# EAGLE design motor (EAGLE 9.2.2)

## Sheet 1 of 2
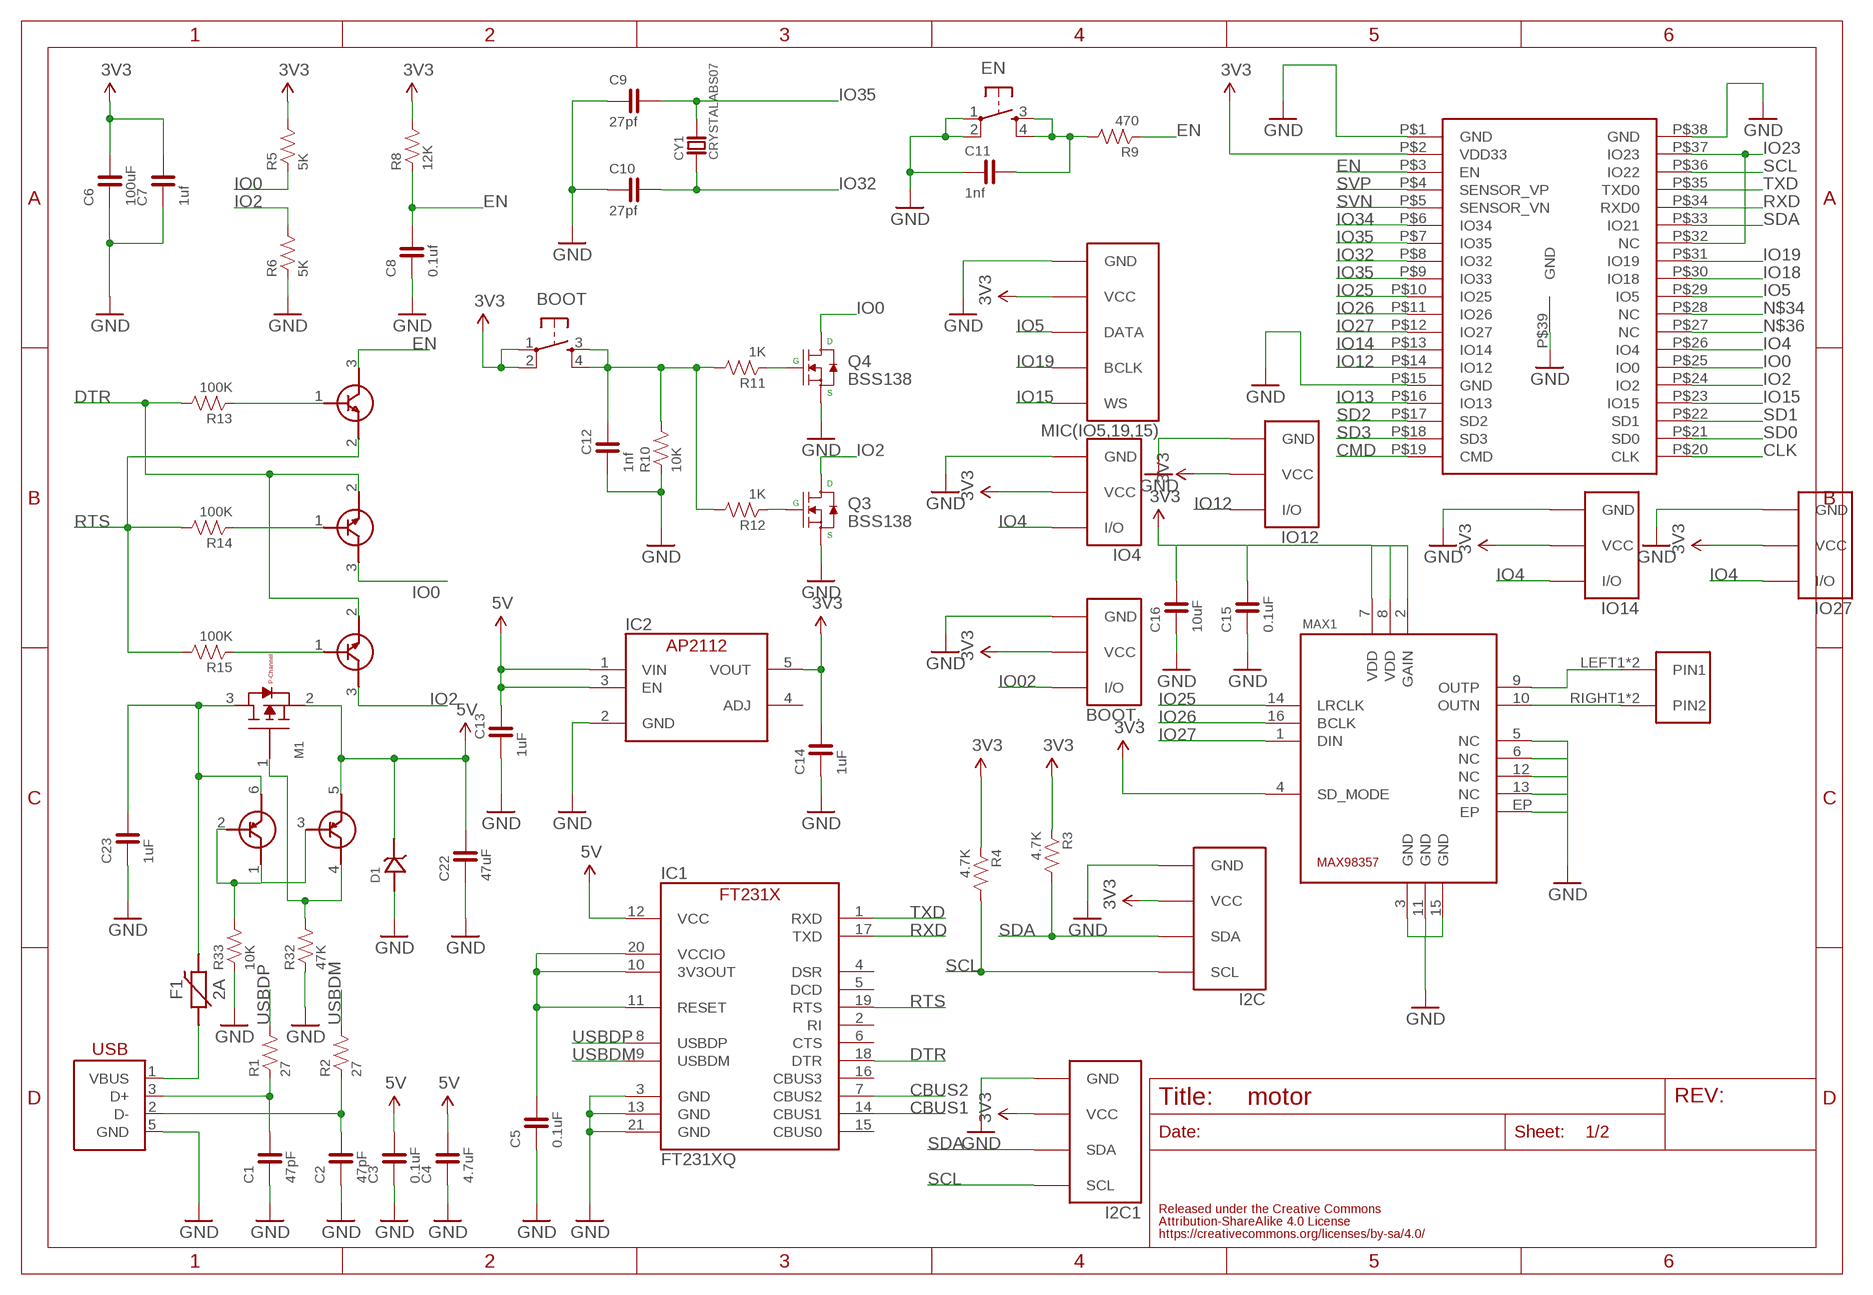
[diagram p0: schematic, sheet 1]

### Parts
BOOT  TACT-SWITCH-SMD_KMR2  [KMR2]
BOOT.  BUTTON  FABO_BRICK_3PIN-03B-PASK-1_NAME_BOTTOM  [FABO_BRICK_3PIN_B03B-PASK-1_NAME_BOTTOM]
C1  47pF  CAPACITOR-0603_NARROW  [0603-NARROW]
C2  47pF  CAPACITOR-0603_NARROW  [0603-NARROW]
C3  0.1uF  CAPACITOR-0603_NARROW  [0603-NARROW]
C4  4.7uF  CAPACITOR-0603_NARROW  [0603-NARROW]
C5  0.1uF  CAPACITOR-0603_NARROW  [0603-NARROW]
C6  100uF  CAPACITOR-1206  [1206]
C7  1uf  CAPACITOR-0603_NARROW  [0603-NARROW]
C8  0.1uf  CAPACITOR-0603_NARROW  [0603-NARROW]
C9  27pf  CAPACITOR-0603_NARROW  [0603-NARROW]
C10  27pf  CAPACITOR-0603_NARROW  [0603-NARROW]
C11  1nf  CAPACITOR-0603_NARROW  [0603-NARROW]
C12  1nf  CAPACITOR-0603_NARROW  [0603-NARROW]
C13  1uF  CAPACITOR-0603  [0603]
C14  1uF  CAPACITOR-0603  [0603]
C15  0.1uF  CAPACITOR-0603  [0603]
C16  10uF  CAPACITOR-0603  [0603]
C22  47uF  CAPACITOR-0603_NARROW  [0603-NARROW]
C23  1uF  CAPACITOR-0603_NARROW  [0603-NARROW]
CY1  CRYSTALABS07  [ABRACOM-ABS07-32.768KHZ]
D1  SMBJ5.0  [SMBJ5.0]
EN  TACT-SWITCH-SMD_KMR2  [KMR2]
F1  2A  POLYSWITCH  [NANOSMDC035F]
I2C  FABO_BRICK_I2C-B04B-PASK-1  [FABO_BRICK_I2C_B04B-PASK-1]
I2C1  FABO_BRICK_I2C-B04B-PASK-1  [FABO_BRICK_I2C_B04B-PASK-1]
IC1  FT231XQ  [QFN-20_FT231X]
IC2  AP2112K-3.3TRG1  [SOT-23-5]
IO4  FABO_BRICK_3PIN-03B-PASK-1_NAME_BOTTOM  [FABO_BRICK_3PIN_B03B-PASK-1_NAME_BOTTOM]
IO12  FABO_BRICK_3PIN-03B-PASK-1_NAME_BOTTOM  [FABO_BRICK_3PIN_B03B-PASK-1_NAME_BOTTOM]
IO14  FABO_BRICK_3PIN-03B-PASK-1_NAME_BOTTOM  [FABO_BRICK_3PIN_B03B-PASK-1_NAME_BOTTOM]
IO27  FABO_BRICK_3PIN-03B-PASK-1_NAME_BOTTOM  [FABO_BRICK_3PIN_B03B-PASK-1_NAME_BOTTOM]
M1  MOSFET-P_DMG2305UX  [SOT-23]
MAX1  MA-MAX98357  [MAXIM-MAX98357]
MIC(IO5,19,15)  FABO_BRICK_I2STOP  [FABO_BRICK_I2S_B05B-PARK-1]
Q3  BSS138  MOSFET-N-BSS138  [SOT23-3]
Q4  BSS138  MOSFET-N-BSS138  [SOT23-3]
R1  27  RESISTOR-0603-NARROW  [0603-NARROW]
R2  27  RESISTOR-0603-NARROW  [0603-NARROW]
R3  4.7K  RESISTOR-0603-NARROW  [0603-NARROW]
R4  4.7K  RESISTOR-0603-NARROW  [0603-NARROW]
R5  5K  RESISTOR-0603-NARROW  [0603-NARROW]
R6  5K  RESISTOR-0603-NARROW  [0603-NARROW]
R8  12K  RESISTOR-0603-NARROW  [0603-NARROW]
R9  470  RESISTOR-0603-NARROW  [0603-NARROW]
R10  10K  RESISTOR-0603-NARROW  [0603-NARROW]
R11  1K  RESISTOR-0603-NARROW  [0603-NARROW]
R12  1K  RESISTOR-0603-NARROW  [0603-NARROW]
R13  100K  RESISTOR-0603-NARROW  [0603-NARROW]
R14  100K  RESISTOR-0603-NARROW  [0603-NARROW]
R15  100K  RESISTOR-0603-NARROW  [0603-NARROW]
R32  47K  RESISTOR-0603-NARROW  [0603-NARROW]
R33  10K  RESISTOR-0603-NARROW  [0603-NARROW]
T1  TRANSISTORMMBT2222  [SOT-23]
T2  TRANSISTORMMBT2222  [SOT-23]
T3  TRANSISTORMMBT2222  [SOT-23]
U$1  ESP32-WROVER  [ESP32-WROVER]
U$4  ML-1400-S1  [ML-1400-S1]
U$6  DUAL-PNP-TRANSISTORDMMT5401  [SOT-26]
USB1  USB-MICRO_B_SMT_HIROSE  [ZX62R-B-5P]

### Nets
3V3: BOOT.1 BOOT.2 BOOT..VCC C6.- C7.2 C14.2 C15.2 C16.2 I2C1.VCC I2C.VCC IC2.5(VOUT) IO4.VCC IO12.VCC IO14.VCC IO27.VCC MAX1.2(GAIN) MAX1.4(SD_MODE) MAX1.7(VDD) MAX1.8(VDD) MIC(IO5,19,15).VCC R3.1 R4.1 R5.2 R8.2 U$1.P$2(VDD33) ; also sheet 2
5V: C3.2 C4.2 C13.2 C22.2 D1.ANODE IC1.12(VCC) IC2.1(VIN) IC2.3(EN) M1.2(S) U$6.5(E2) ; also sheet 2
CBUS1: IC1.14(CBUS1)
CBUS2: IC1.7(CBUS2)
CLK: U$1.P$20(CLK)
CMD: U$1.P$19(CMD)
DTR: IC1.18(DTR) R13.2 T2.2(E) T3.2(E)
EN: C8.2 R8.1 R9.1 T1.3(C) U$1.P$3(EN)
GND: BOOT..GND C1.1 C2.1 C3.1 C4.1 C5.1 C6.+ C7.1 C8.1 C9.1 C10.1 C11.1 C12.1 C13.1 C14.1 C15.1 C16.1 C22.1 C23.1 D1.CATHODE EN.1 EN.2 I2C1.GND I2C.GND IC1.3(GND) IC1.13(GND) IC1.21(GND) IC2.2(GND) IO4.GND IO12.GND IO14.GND IO27.GND MAX1.3(GND) MAX1.5(NC) MAX1.6(NC) MAX1.11(GND) MAX1.12(NC) MAX1.13(NC) MAX1.15(GND) MAX1.EP MIC(IO5,19,15).GND Q3.2(S) Q4.2(S) R6.1 R10.1 R32.1 R33.1 U$1.P$1(GND) U$1.P$15(GND) U$1.P$38(GND) U$1.P$39(GND) USB1.5(GND) ; also sheet 2
IO0: Q4.3(D) R5.1 T2.3(C) U$1.P$25(IO0)
IO2: Q3.3(D) R6.2 T3.3(C) U$1.P$24(IO2)
IO02: BOOT..I/O
IO4: IO4.I/O IO14.I/O IO27.I/O U$1.P$26(IO4)
IO5: MIC(IO5,19,15).DATA U$1.P$29(IO5)
IO12: IO12.I/O U$1.P$14(IO12)
IO13: U$1.P$16(IO13)
IO14: U$1.P$13(IO14)
IO15: MIC(IO5,19,15).WS U$1.P$23(IO15)
IO18: U$1.P$30(IO18)
IO19: MIC(IO5,19,15).BCLK U$1.P$31(IO19)
IO23: U$1.P$32(NC) U$1.P$37(IO23)
IO25: MAX1.14(LRCLK) U$1.P$10(IO25)
IO26: MAX1.16(BCLK) U$1.P$11(IO26)
IO27: MAX1.1(DIN) U$1.P$12(IO27)
IO32: C10.2 CY1.P$1 U$1.P$8(IO32)
IO34: U$1.P$6(IO34) ; also sheet 2
IO35: C9.2 CY1.P$2 U$1.P$7(IO35) U$1.P$9(IO33) ; also sheet 2
N$1: R13.1 T1.1(B)
N$2: R14.1 T2.1(B)
N$3: C2.2 R2.1 USB1.2(D-)
N$4: C1.2 R1.1 USB1.3(D+)
N$5: C11.2 EN.3 EN.4 R9.2
N$6: BOOT.3 BOOT.4 C12.2 R10.2 R11.2 R12.2
N$7: C5.2 IC1.10(3V3OUT) IC1.11(RESET) IC1.20(VCCIO)
N$8: R15.1 T3.1(B)
N$9: MAX1.10(OUTN) U$4.RIGHT1(PIN2) U$4.RIGHT2(PIN2)
N$10: MAX1.9(OUTP) U$4.LEFT1(PIN1) U$4.LEFT2(PIN1)
N$11: Q4.1(G) R11.1
N$12: Q3.1(G) R12.1
N$16: C23.2 F1.2 M1.3(D) U$6.6(E1)
N$17: M1.1(G) R32.2 U$6.4(C2)
N$26: R33.2 U$6.1(C1) U$6.2(B1) U$6.3(B2)
N$34: U$1.P$28(NC)
N$36: U$1.P$27(NC)
RTS: IC1.19(RTS) R14.2 R15.2 T1.2(E)
RXD: IC1.17(TXD) U$1.P$34(RXD0)
SCL: I2C1.SCL I2C.SCL R4.2 U$1.P$36(IO22) ; also sheet 2
SD0: U$1.P$21(SD0)
SD1: U$1.P$22(SD1)
SD2: U$1.P$17(SD2)
SD3: U$1.P$18(SD3)
SDA: I2C1.SDA I2C.SDA R3.2 U$1.P$33(IO21) ; also sheet 2
SVN: U$1.P$5(SENSOR_VN)
SVP: U$1.P$4(SENSOR_VP)
TXD: IC1.1(RXD) U$1.P$35(TXD0)
USBDM: IC1.9(USBDM) R2.2 ; also sheet 2
USBDP: IC1.8(USBDP) R1.2 ; also sheet 2
VBUS: F1.1 USB1.1(VBUS)
Unconnected: IC1.2(RI) IC1.4(DSR) IC1.5(DCD) IC1.6(CTS) IC1.15(CBUS0) IC1.16(CBUS3) IC2.4(ADJ)

## Sheet 2 of 2
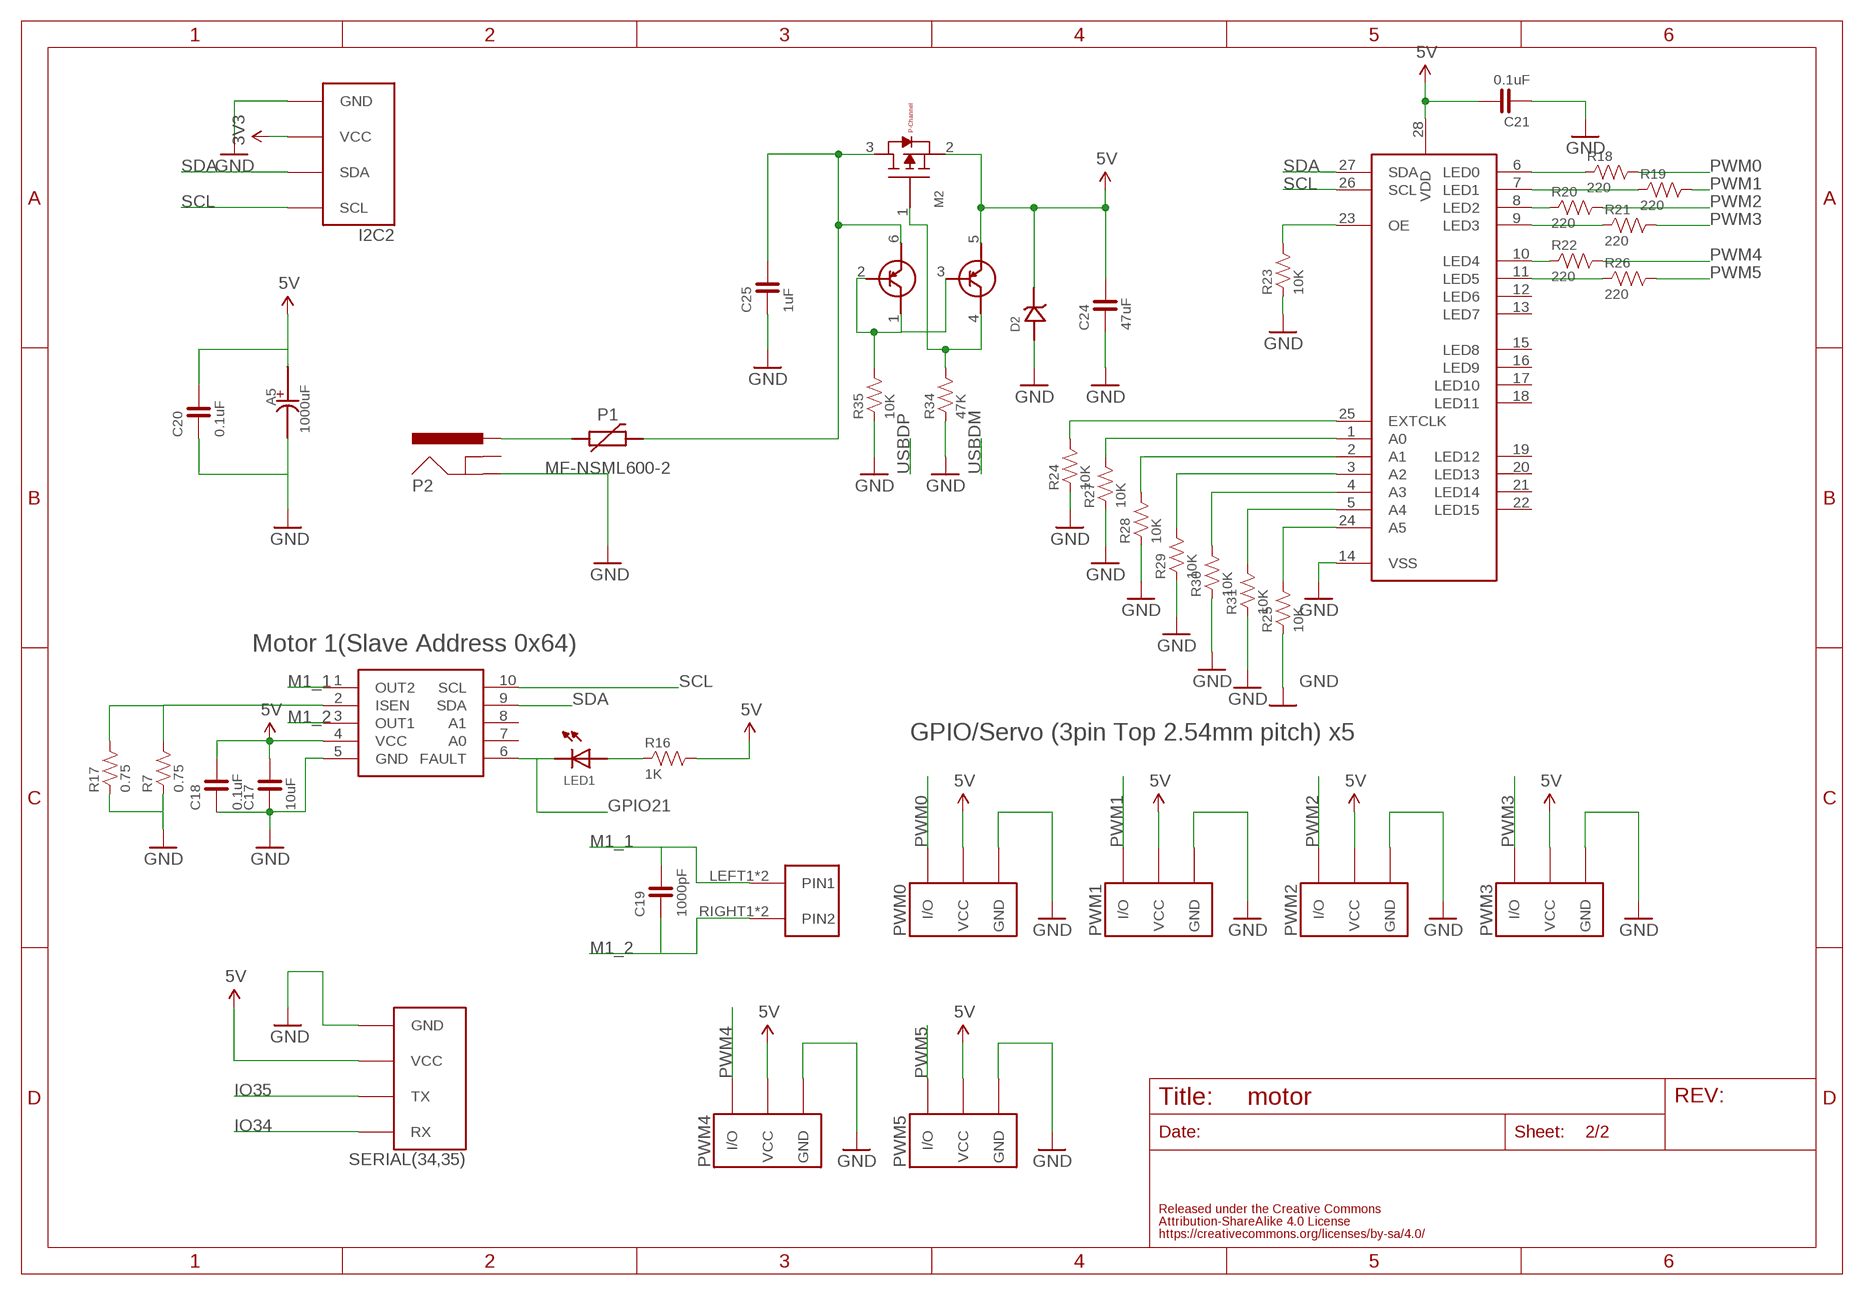
[diagram p1: schematic, sheet 2]

### Parts
A5  1000uF  CAPACITOR-ALUMIN_D12_5  [D12.5]
C17  10uF  CAPACITOR-0603  [0603]
C18  0.1uF  CAPACITOR-0603  [0603]
C19  1000pF  CAPACITOR-0603  [0603]
C20  0.1uF  CAPACITOR-0603  [0603]
C21  0.1uF  CAPACITOR-0603  [0603]
C24  47uF  CAPACITOR-0603_NARROW  [0603-NARROW]
C25  1uF  CAPACITOR-0603_NARROW  [0603-NARROW]
D2  SMBJ5.0  [SMBJ5.0]
I2C2  FABO_BRICK_I2C-B04B-PASK-1  [FABO_BRICK_I2C_B04B-PASK-1]
LED1  LED-0603  [0603]
M2  MOSFET-P_DMG2305UX  [SOT-23]
P1  MF-NSML600-2  POLYSWITCH1206  [1206]
P2  DC-JACKM04339A0  [M04339A0]
PWM0  FABO_BRICK_3PIN-HEADER  [FABO_BRICK_3PIN_HEADER]
PWM1  FABO_BRICK_3PIN-HEADER  [FABO_BRICK_3PIN_HEADER]
PWM2  FABO_BRICK_3PIN-HEADER  [FABO_BRICK_3PIN_HEADER]
PWM3  FABO_BRICK_3PIN-HEADER  [FABO_BRICK_3PIN_HEADER]
PWM4  FABO_BRICK_3PIN-HEADER  [FABO_BRICK_3PIN_HEADER]
PWM5  FABO_BRICK_3PIN-HEADER  [FABO_BRICK_3PIN_HEADER]
R7  0.75  RESISTOR-0603  [0603]
R16  1K  RESISTOR-0603  [0603]
R17  0.75  RESISTOR-0603  [0603]
R18  220  RESISTOR-0603  [0603]
R19  220  RESISTOR-0603  [0603]
R20  220  RESISTOR-0603  [0603]
R21  220  RESISTOR-0603  [0603]
R22  220  RESISTOR-0603  [0603]
R23  10K  RESISTOR-0603  [0603]
R24  10K  RESISTOR-0603  [0603]
R25  10K  RESISTOR-0603  [0603]
R26  220  RESISTOR-0603  [0603]
R27  10K  RESISTOR-0603  [0603]
R28  10K  RESISTOR-0603  [0603]
R29  10K  RESISTOR-0603  [0603]
R30  10K  RESISTOR-0603  [0603]
R31  10K  RESISTOR-0603  [0603]
R34  47K  RESISTOR-0603-NARROW  [0603-NARROW]
R35  10K  RESISTOR-0603-NARROW  [0603-NARROW]
SERIAL(34,35)  FABO_BRICK_SERIAL-B04B-PASK-1  [FABO_BRICK_SERIAL_B04B-PASK-1]
U$7  DUAL-PNP-TRANSISTORDMMT5401  [SOT-26]
U$8  DRV8830  [DRV8830]
U$9  PCA9685  [PCA9685]
U$12  ML-1400-S1  [ML-1400-S1]

### Nets
3V3: I2C2.VCC ; also sheet 1
5V: A5.+ C17.2 C18.2 C20.2 C21.2 C24.2 D2.ANODE M2.2(S) PWM0.VCC PWM1.VCC PWM2.VCC PWM3.VCC PWM4.VCC PWM5.VCC R16.2 SERIAL(34,35).VCC U$7.5(E2) U$8.4(VCC) U$9.28(VDD) ; also sheet 1
GND: A5.- C17.1 C18.1 C20.1 C21.1 C24.1 C25.1 D2.CATHODE I2C2.GND P2.GND PWM0.GND PWM1.GND PWM2.GND PWM3.GND PWM4.GND PWM5.GND R7.1 R17.1 R23.1 R24.1 R25.1 R27.1 R28.1 R29.1 R30.1 R31.1 R34.1 R35.1 SERIAL(34,35).GND U$8.5(GND) U$9.14(VSS) ; also sheet 1
GPIO21: LED1.CATHODE U$8.6(FAULT)
IO34: SERIAL(34,35).RX ; also sheet 1
IO35: SERIAL(34,35).TX ; also sheet 1
LED0: R18.1 U$9.6(LED0)
LED1: R19.1 U$9.7(LED1)
LED2: R20.1 U$9.8(LED2)
LED3: R21.1 U$9.9(LED3)
LED4: R22.1 U$9.10(LED4)
LED5: R26.1 U$9.11(LED5)
M1_1: C19.2 U$8.1(OUT2) U$12.LEFT1(PIN1) U$12.LEFT2(PIN1)
M1_2: C19.1 U$8.3(OUT1) U$12.RIGHT1(PIN2) U$12.RIGHT2(PIN2)
N$13: R7.2 R17.2 U$8.2(ISEN)
N$14: LED1.ANODE R16.1
N$15: P1.P$1 P2.VCC(PWR)
N$18: R23.2 U$9.23(OE)
N$19: R24.2 U$9.25(EXTCLK)
N$20: R27.2 U$9.1(A0)
N$21: R28.2 U$9.2(A1)
N$22: R29.2 U$9.3(A2)
N$23: R30.2 U$9.4(A3)
N$24: R31.2 U$9.5(A4)
N$25: R25.2 U$9.24(A5)
N$28: C25.2 M2.3(D) P1.P$2 U$7.6(E1)
N$29: M2.1(G) R34.2 U$7.4(C2)
N$30: R35.2 U$7.1(C1) U$7.2(B1) U$7.3(B2)
PWM0: PWM0.I/O R18.2
PWM1: PWM1.I/O R19.2
PWM2: PWM2.I/O R20.2
PWM3: PWM3.I/O R21.2
PWM4: PWM4.I/O R22.2
PWM5: PWM5.I/O R26.2
SCL: I2C2.SCL U$8.10(SCL) U$9.26(SCL) ; also sheet 1
SDA: I2C2.SDA U$8.9(SDA) U$9.27(SDA) ; also sheet 1
Unconnected: P2.GNDBREAK U$8.7(A0) U$8.8(A1) U$9.12(LED6) U$9.13(LED7) U$9.15(LED8) U$9.16(LED9) U$9.17(LED10) U$9.18(LED11) U$9.19(LED12) U$9.20(LED13) U$9.21(LED14) U$9.22(LED15)

### Notes on the sheet
- Motor 1(Slave Address 0x64)
- GPIO/Servo (3pin Top 2.54mm pitch) x5

## Library data of the parts
A5 = FaBo-Capacitor:CAPACITOR-ALUMIN
BOOT EN = FaBo-Switch:TACT-SWITCH
BOOT. IO4 IO12 IO14 IO27 PWM0 PWM1-PWM5 = FaBo-Template:FABO_BRICK_3PIN: FaBo Brick 3pin
C1-C25 = FaBo-Capacitor:CAPACITOR: CAPACITOR
CY1 = FaBo-Crystal:CRYSTAL
D1 D2 = FaBo-Diode:SMBJ5.0
F1 = FaBo-Parts:POLYSWITCH
I2C I2C1 I2C2 = FaBo-Template:FABO_BRICK_I2C: FaBo Brick I2C
IC1 = FaBo-USB:FT231X
IC2 = FaBo-Supply:AP2112
LED1 = FaBo-LED:LED
M1 M2 = FaBo-Mosfet:MOSFET-P
MAX1 = FaBo-Mems:MA-MAX98357
MIC(IO5,19,15) = FaBo-Template:FABO_BRICK_I2S
P1 = FaBo-Supply:POLYSWITCH
P2 = FaBo-Supply:DC-JACK
Q3 Q4 = FaBo-etc:MOSFET-N
R1-R35 = FaBo-Resistors:RESISTOR: RESISTOR
SERIAL(34,35) = FaBo-Template:FABO_BRICK_SERIAL: FaBo Brick Serial
T1-T3 = FaBo-Transistor:TRANSISTOR
U$1 = FaBo-ESP32:ESP32-WROVER
U$4 U$12 = FaBo-Terminal:ML-1400-S1
U$6 U$7 = FaBo-Transistor:DUAL-PNP-TRANSISTOR
U$8 = FaBo-Motor:DRV8830
U$9 = FaBo-Motor:PCA9685
USB1 = FaBo-USB:USB

## Board
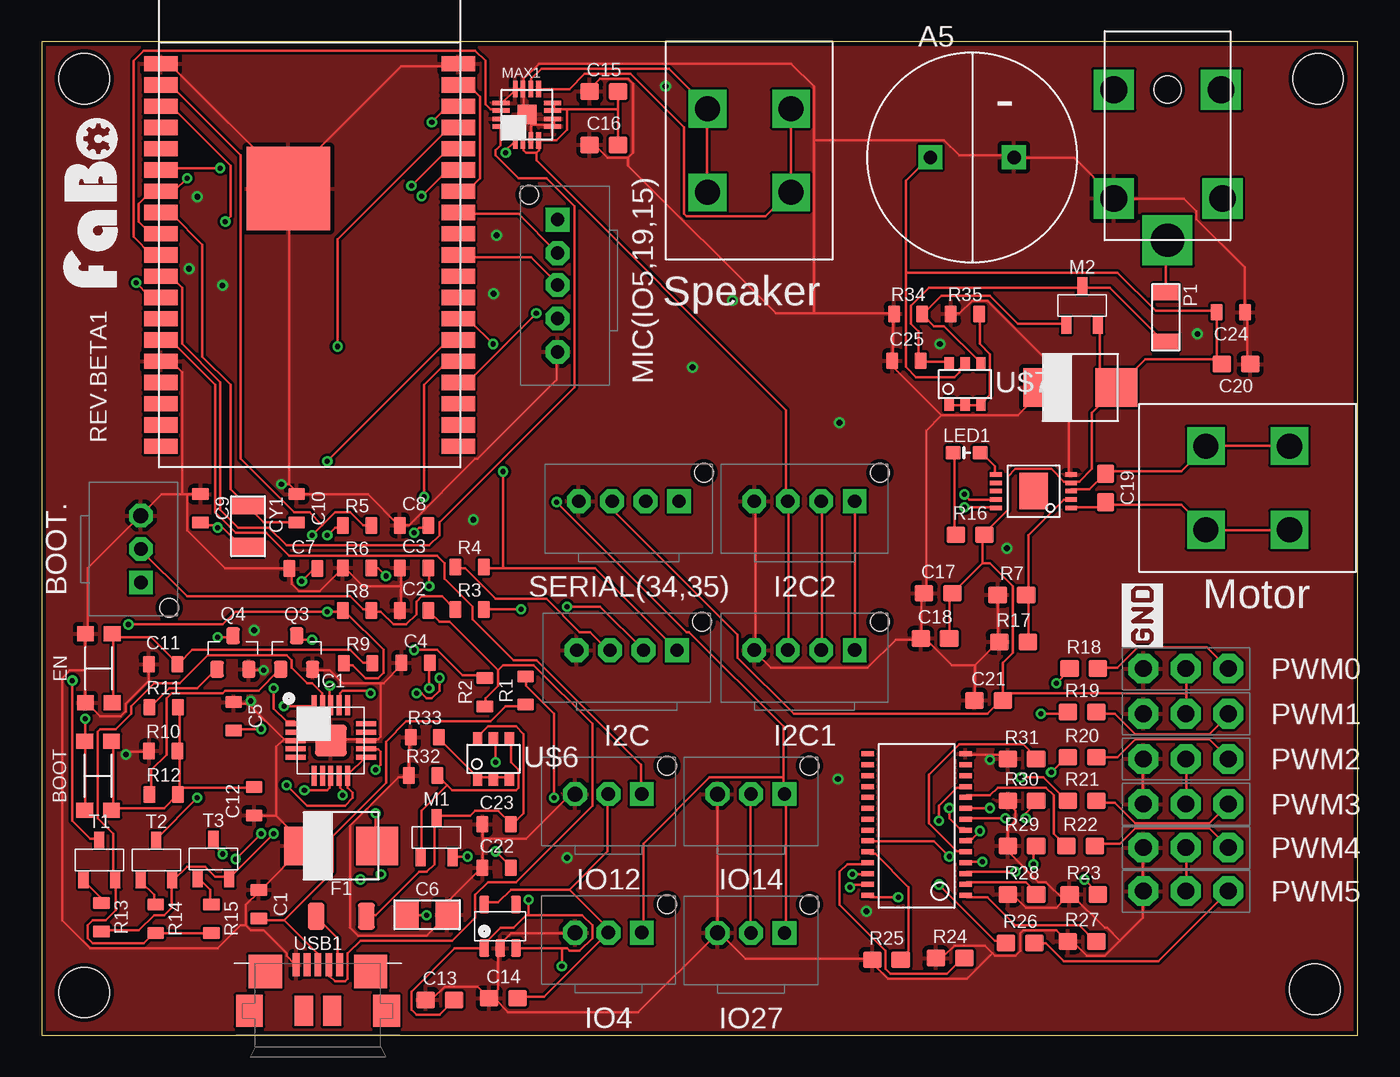
[diagram p2: board, top side]
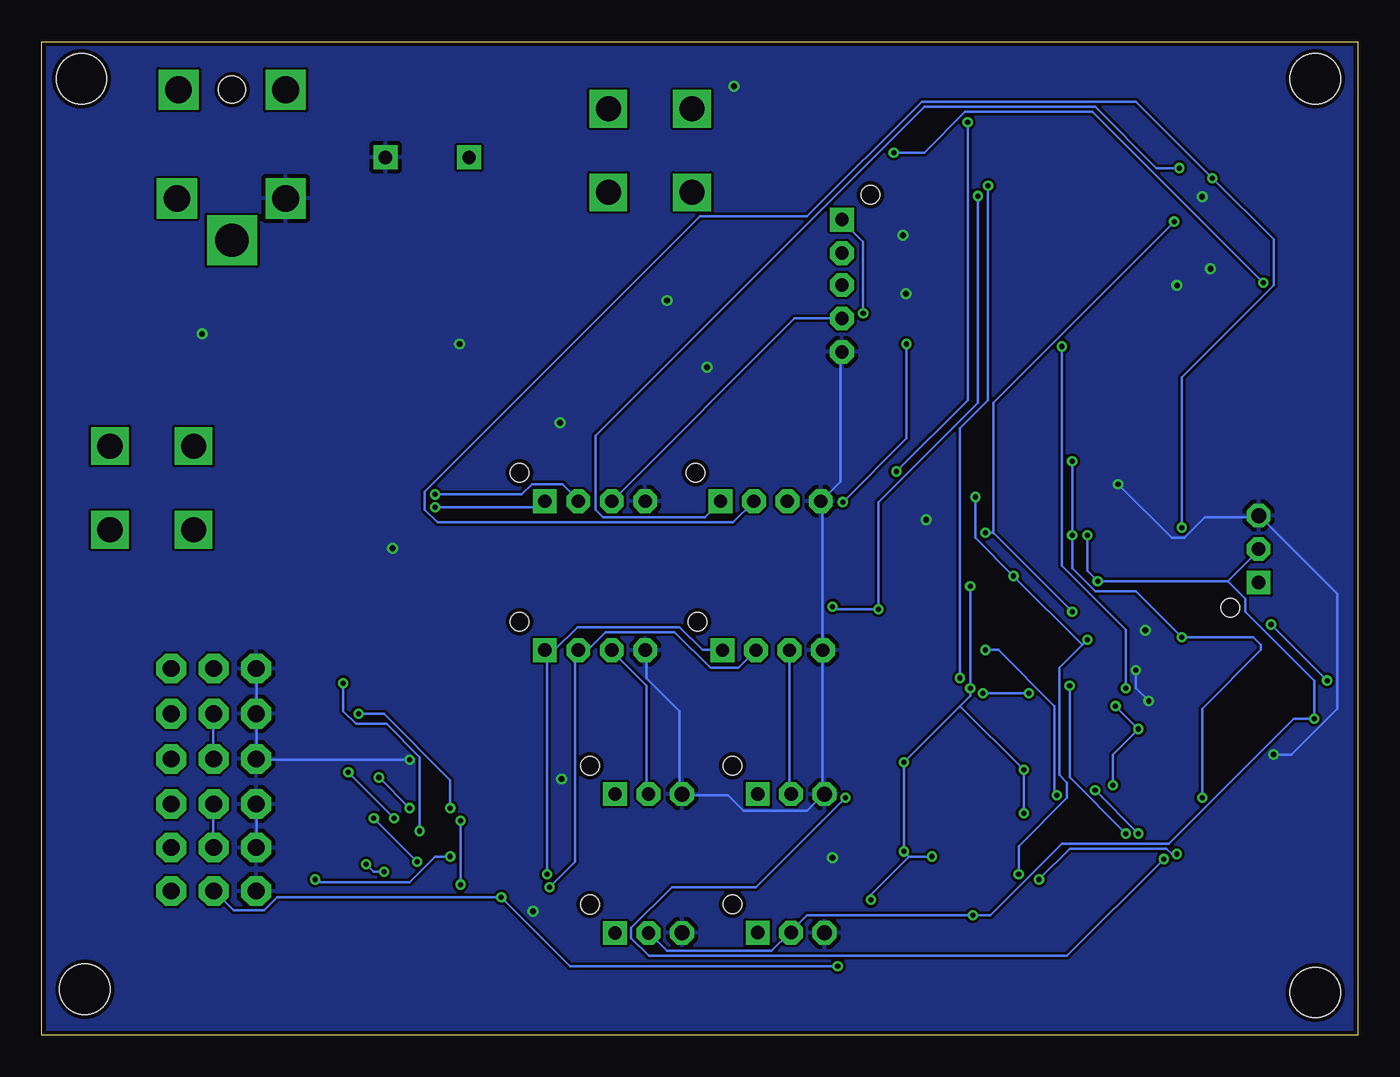
[diagram p3: board, bottom side, seen from below]

Size 78.67 x 59.36 mm. Coordinates in mm from the lower left corner, seen from the top.
Outline: 0,59.36 0,0 78.67,0 78.67,59.36 0,59.36
Copper layers (1*16): Top 0.035mm / dielectric 1.5mm / Bottom 0.035mm
Design rules "SeeedStudio_2layer_DRU_no_angle_20140221": minimum track width 6mil, minimum drill 12mil, track to track 6mil, track to pad 6mil, pad to pad 6mil, via to via 6mil, smd to smd 0mil, copper to edge 10mil, drill to drill 10mil, minimum pad ring 10mil, minimum via ring 6mil, stop-mask expansion 2mil, vias tented up to drill 100mil, thermal gap 10mil
Holes 3 mm at 2.54,57.15 2.54,2.54 76.1,2.74 76.3,57.15

### Footprints (pad centres in the part's own frame; a part is rotated, then mirrored left to right if it is on the bottom)
D12.5 = drill 0.8 pad 1.422 square: + -2.472,0.254; - 2.528,0.254
KMR2 = smd 0.9 x 1: 1 -2.05,0.8; 2 2.05,0.8; 3 2.05,-0.8; 4 -2.05,-0.8
FABO_BRICK_3PIN_B03B-PASK-1_NAME_BOTTOM = drill 0.9 pad 1.422 octagon: GND -2,0 | drill 0.8 pad 1.422 square: I/O 2,0 | drill 0.8 pad 1.422 octagon: VCC 0,0 | hole 1.1: 3.5,1.7
0603-NARROW = smd 0.71 x 1: 1 -0.85,0; 2 0.85,0
1206 = smd 1.4 x 1.6: + 1.2,0; - -1.2,0
0603 = smd 1.1 x 1: 1 -0.85,0; 2 0.85,0
ABRACOM-ABS07-32.768KHZ = smd 1.1 x 1.9: P$1 -1.25,0; P$2 1.25,0
SMBJ5.0 = smd 2.5 x 2.3: ANODE 2.15,0; CATHODE -2.15,0
NANOSMDC035F = smd 1 x 1.6: 1 -1.5,0; 2 1.5,0
FABO_BRICK_I2C_B04B-PASK-1 = drill 0.8 pad 1.422 octagon: GND -3,0; SDA 1,0; VCC -1,0 | drill 0.8 pad 1.422 square: SCL 3,0 | hole 1.1: 4.5,1.7
QFN-20_FT231X = smd 1.2 x 0.3: 1 -2.1,1; 2 -2.1,0.5; 3 -2.1,0; 4 -2.1,-0.5; 5 -2.1,-1; 11 2.1,-1; 12 2.1,-0.5; 13 2.1,0; 14 2.1,0.5; 15 2.1,1 | smd 0.3 x 1.2: 6 -1,-2.1; 7 -0.5,-2.1; 8 0,-2.1; 9 0.5,-2.1; 10 1,-2.1; 16 1,2.1; 17 0.5,2.1; 18 0,2.1; 19 -0.5,2.1; 20 -1,2.1 | smd 1.9 x 1.9: 21 0,0
SOT-23-5 = smd 0.6 x 1.05: 1 -0.95,-1.3; 2 0,-1.3; 3 0.95,-1.3; 4 0.95,1.3; 5 -0.95,1.3
0603' = smd 0.9 x 0.8: ANODE -0.8,0; CATHODE 0.8,0
SOT-23 = smd 0.6 x 1: 1 -0.95,-1.2; 2 0.95,-1.2; 3 0,1.2
MAXIM-MAX98357 = smd 0.27 x 1: 1 -0.7,-1.54; 2 -0.25,-1.54; 3 0.25,-1.54; 4 0.7,-1.54; 9 0.7,1.54; 10 0.25,1.54; 11 -0.25,1.54; 12 -0.7,1.54 | smd 1 x 0.27: 5 1.54,-0.7; 6 1.54,-0.25; 7 1.54,0.25; 8 1.54,0.7; 13 -1.54,0.7; 14 -1.54,0.25; 15 -1.54,-0.25; 16 -1.54,-0.7 | smd 1.143 x 1.143: EP 0.005,0.02
FABO_BRICK_I2S_B05B-PARK-1 = drill 0.8 pad 1.422 octagon: BCLK 1.635,2.54; DATA -0.27,2.54; GND -4.27,2.54; VCC -2.27,2.54 | drill 0.8 pad 1.422 square: WS 3.635,2.54 | hole 1.1: 5.135,4.24
1206' = smd 1 x 1.6: P$1 -1.5,0; P$2 1.5,0
M04339A0 = drill 1.6 square: GND -3.2,-6.5; GNDBREAK 3.3,-6.5; ND1 -3.2,0; ND2 3.2,0 | drill 2 square: VCC 0,-9 | hole 1.6: 0,0
FABO_BRICK_3PIN_HEADER = drill 1 pad 1.778 octagon: GND -2.54,0; I/O 2.54,0; VCC 0,0
SOT23-3 = smd 0.8 x 1: 1 -0.95,-1; 2 0.95,-1; 3 0,1
FABO_BRICK_SERIAL_B04B-PASK-1 = drill 0.8 pad 1.422 octagon: GND -3,0; TX 1,0; VCC -1,0 | drill 0.8 pad 1.422 square: RX 3,0 | hole 1.1: 4.5,1.7
ESP32-WROVER = smd 2 x 0.9: P$1 -8.89,8.89; P$2 -8.89,7.62; P$3 -8.89,6.35; P$4 -8.89,5.08; P$5 -8.89,3.81; P$6 -8.89,2.54; P$7 -8.89,1.27; P$8 -8.89,0; P$9 -8.89,-1.27; P$10 -8.89,-2.54; P$11 -8.89,-3.81; P$12 -8.89,-5.08; P$13 -8.89,-6.35; P$14 -8.89,-7.62; P$15 -8.89,-8.89; P$16 -8.89,-10.16; P$17 -8.89,-11.43; P$18 -8.89,-12.7; P$19 -8.89,-13.97; P$20 8.89,-13.97; P$21 8.89,-12.7; P$22 8.89,-11.43; P$23 8.89,-10.16; P$24 8.89,-8.89; P$25 8.89,-7.62; P$26 8.89,-6.35; P$27 8.89,-5.08; P$28 8.89,-3.81; P$29 8.89,-2.54; P$30 8.89,-1.27; P$31 8.89,0; P$32 8.89,1.27; P$33 8.89,2.54; P$34 8.89,3.81; P$35 8.89,5.08; P$36 8.89,6.35; P$37 8.89,7.62; P$38 8.89,8.89 | smd 5 x 5: P$39 -1.27,1.43
ML-1400-S1 = drill 1.5 square: LEFT1 -2.5,2.5; LEFT2 -2.5,-2.5; RIGHT1 2.5,2.5; RIGHT2 2.5,-2.5
SOT-26 = smd 0.55 x 0.8: 1 -0.95,-1.2; 2 0,-1.2; 3 0.95,-1.2; 4 0.95,1.2; 5 0,1.2; 6 -0.95,1.2
DRV8830 = smd 0.27 x 0.7: 1 -1,-2.24; 2 -0.5,-2.24; 3 0,-2.24; 4 0.5,-2.24; 5 1,-2.24; 6 1,2.26; 7 0.5,2.26; 8 0,2.26; 9 -0.5,2.26; 10 -1,2.26 | smd 2.18 x 1.72: P$1 0,0
PCA9685 = smd 0.3 x 0.75: 1 -4.15,-2.93; 2 -3.5,-2.93; 3 -2.85,-2.93; 4 -2.2,-2.93; 5 -1.55,-2.93; 6 -0.9,-2.93; 7 -0.25,-2.93; 8 0.4,-2.93; 9 1.05,-2.93; 10 1.7,-2.93; 11 2.35,-2.93; 12 3,-2.93; 13 3.65,-2.93; 14 4.3,-2.93; 15 4.3,2.92; 16 3.65,2.92; 17 3,2.92; 18 2.35,2.92; 19 1.7,2.92; 20 1.05,2.92; 21 0.4,2.92; 22 -0.25,2.92; 23 -0.9,2.92; 24 -1.55,2.92; 25 -2.2,2.92; 26 -2.85,2.92; 27 -3.5,2.92; 28 -4.15,2.92
ZX62R-B-5P = smd 0.4 x 1.35: 1 1.3,4.2; 2 0.65,4.2; 3 0,4.2; 4 -0.65,4.2; 5 -1.3,4.2 | smd 2 x 2: 6 3.15,3.8; 7 -3.15,3.8 | smd 1.6 x 1.9: 8 4.1,1.45; 11 -4.1,1.45 | smd 1.1 x 1.8: 9 0.85,1.45; 10 -0.85,1.45

### Placement (x,y rotation side)
A5  55.6,52.2 0 top
BOOT  3.37,15.49 90 top
BOOT.  5.92,29.05 270 top
C1  12.97,7.82 270 top
C2  22.25,25.38 0 top
C3  22.25,27.92 0 top
C4  22.35,22.25 0 top
C5  11.47,19.05 270 top
C6  23.04,7.19 0 top
C7  15.64,27.88 0 top
C8  22.25,30.46 0 top
C9  9.49,31.48 270 top
C10  15.24,31.48 270 top
C11  7.25,22.16 0 top
C12  12.7,13.97 90 top
C13  23.8,2.1 0 top
C14  27.6,2.2 0 top
C15  33.6,56.4 0 top
C16  33.6,53.2 0 top
C17  53.6,26.4 0 top
C18  53.4,23.7 0 top
C19  63.6,32.7 270 top
C20  71.4,40.1 180 top
C21  56.6,20 0 top
C22  27.2,10 0 top
C23  27.2,12.6 0 top
C24  71.1,43.2 180 top
C25  51.7,40.3 0 top
CY1  12.33,30.41 270 top
D1  17.9,11.3 0 top
D2  62.1,38.7 0 top
EN  3.4,21.92 90 top
F1  17.9,7.1 0 top
I2C  34.98,23 0 top
I2C1  45.6,23 0 top
I2C2  45.6,31.9 0 top
IC1  17.28,17.6 0 top
IC2  27.4,6.5 0 top
IO4  33.88,6.12 0 top
IO12  33.88,14.4 0 top
IO14  42.4,14.4 0 top
IO27  42.4,6.1 0 top
LED1  [0603']  55.3,34.8 0 top
M1  23.6,11.8 0 top
M2  62.2,43.6 0 top
MAX1  29,55 0 top
MIC(IO5,19,15)  33.38,45.09 90 top
P1  MF-NSML600-2  [1206']  67.2,42.9 270 top
P2  67.3,56.5 0 top
PWM0  68.4,21.9 0 top
PWM1  68.4,19.2 0 top
PWM2  68.4,16.5 0 top
PWM3  68.4,13.8 0 top
PWM4  68.4,11.2 0 top
PWM5  68.4,8.6 0 top
Q3  15.24,22.86 0 top
Q4  11.43,22.86 0 top
R1  28.92,20.59 90 top
R2  26.48,20.49 90 top
R3  25.57,25.43 0 top
R4  25.57,27.98 0 top
R5  18.84,30.46 0 top
R6  18.84,27.92 0 top
R7  58,26.3 0 top
R8  18.84,25.38 0 top
R9  18.91,22.21 0 top
R10  7.27,16.98 0 top
R11  7.29,19.59 0 top
R12  7.28,14.38 0 top
R13  3.57,7.05 270 top
R14  6.81,6.95 270 top
R15  10.15,6.95 270 top
R16  55.5,29.9 0 top
R17  58.1,23.5 0 top
R18  62.3,21.9 0 top
R19  62.2,19.3 0 top
R20  62.2,16.6 0 top
R21  62.2,14 0 top
R22  62.1,11.3 0 top
R23  62.3,8.4 0 top
R24  54.3,4.6 0 top
R25  50.5,4.5 0 top
R26  58.5,5.5 0 top
R27  62.2,5.6 0 top
R28  58.6,8.4 0 top
R29  58.6,11.3 0 top
R30  58.6,14 0 top
R31  58.6,16.5 0 top
R32  22.8,15.5 0 top
R33  22.9,17.8 0 top
R34  51.8,43.1 0 top
R35  55.2,43.1 0 top
SERIAL(34,35)  35.1,31.9 0 top
T1  3.44,10.46 0 top
T2  6.85,10.46 0 top
T3  10.26,10.52 0 top
U$1  16.01,49.16 0 top
U$4  42.3,52.86 180 top
U$5  [LOGO_FABO_MS]  4.9,49.75 90 top
U$6  27,16.5 0 top
U$7  55.2,38.9 0 top
U$8  59.3,32.5 90 top
U$9  52.3,12.5 90 top
U$12  72.1,32.7 90 top
U$19  [LOGO_SILK_GND]  67.07,23.17 90 top
USB1  16.51,0 0 top

### Tracks (layer width: path | path; a pad name or v marks a point on that pad's centre or on a via)
3V3  (via drill 0.3)
  Top 0.152: R3.1 24.69,25.45 23.93,26.21 22.71,26.21 22.4,25.91 22.4,25.15 21.79,24.54 21.03,24.54 20.27,25.3 19.81,25.3 R8.2 19.66,25.45 19.2,25.45 18.44,26.21 8.69,26.21 5.94,28.96 BOOT..VCC | BOOT.1 2.59,13.56 2.59,17.53 BOOT.2 2.59,17.68 v2.59,18.9 | v15.54,27.13 16.15,27.74 16.46,27.74 C7.2 | v16.15,29.87 16.76,30.48 | 16.76,30.48 17.53,31.24 18.44,31.24 19.2,30.48 19.66,30.48 R5.2 | 16.76,30.48 16,31.24 15.09,31.24 11.89,34.44 11.89,52.58 7.77,56.69 7.16,56.69 U$1.P$2 | R4.1 24.84,27.89 25.3,27.89 27.13,26.06 30.18,26.06 32.16,24.08 32.77,24.08 33.83,23.01 I2C.VCC | 31.55,8.69 28.04,8.69 27.28,7.92 26.52,7.92 IC2.5 | 31.55,8.69 33.98,6.25 IO4.VCC 33.83,6.1 30.02,2.29 28.5,2.29 C14.2 | v23.01,7.16 21.95,7.16 C6.- | 31.55,8.69 33.83,10.97 33.83,14.33 IO12.VCC | IO27.VCC 42.37,6.25 42.37,14.33 IO14.VCC | 29.57,52.73 28.96,52.73 28.8,52.88 28.8,53.34 MAX1.2 | 29.57,52.73 29.72,52.88 29.72,53.34 MAX1.4 29.72,53.49 30.79,53.49 31.39,54.1 31.39,55.32 | 30.63,55.32 30.63,55.63 MAX1.8 | 34.44,55.32 34.44,56.39 C15.2 | 34.44,55.32 34.44,53.34 C16.2 | 34.44,55.32 31.39,55.32 | 31.39,55.32 30.63,55.32 | 30.63,55.32 MAX1.7 | I2C1.VCC 44.65,23.01 44.65,31.85 I2C2.VCC 44.5,32 44.5,37.34 29.57,52.27 29.57,52.73
  Bottom 0.152: 7.77,27.13 v15.54,27.13 16.15,27.74 v16.15,29.87 | 7.77,27.13 5.94,28.96 BOOT..VCC | 7.77,27.13 6.71,26.06 6.71,25.3 2.59,21.18 v2.59,18.9 3.81,18.9 11.28,11.43 17.68,11.43 21.95,7.16 v23.01,7.16 32.92,7.16 33.83,6.25 IO4.VCC 33.98,6.1 35.05,5.03 41.3,5.03 42.37,6.1 IO27.VCC | I2C.VCC 33.98,22.86 33.98,14.48 IO12.VCC | MIC(IO5,19,15).VCC 30.94,42.82 33.68,42.82 44.5,32 I2C2.VCC | IO14.VCC 42.52,14.48 42.52,20.88 44.5,22.86 I2C1.VCC
5V  (via drill 0.3)
  Top 0.152: 51.66,45.57 51.66,51.05 53.03,52.43 A5.+ | 51.66,45.57 51.66,39.93 52.27,39.32 54.56,39.32 54.86,39.62 54.86,39.78 55.17,40.08 U$7.5 | 70.26,40.39 70.26,43.13 C24.2 70.1,43.28 66.6,43.28 64.31,45.57 51.66,45.57 | 70.26,40.39 70.41,40.23 C20.2 70.26,40.39 | D2.ANODE 64.16,38.56 62.79,37.19 62.79,33.83 62.03,33.07 61.57,33.07 U$8.4 61.42,33.07 61.11,33.07 60.35,33.83 58.22,33.83 57.76,33.38 57.76,31.39 56.39,30.02 R16.2 56.24,29.87 56.24,28.19 | M2.2 63.25,42.37 63.25,39.62 64.16,38.71 D2.ANODE | 70.26,40.39 65.99,40.39 64.31,38.71 D2.ANODE | C13.2 24.54,1.98 23.77,1.22 22.4,1.22 22.1,1.52 22.1,2.59 24.69,5.18 26.36,5.18 IC2.1 26.36,5.33 27.43,6.4 28.19,6.4 28.96,7.16 29.11,7.16 | 31.09,5.18 31.39,5.18 31.55,5.03 32.16,5.03 32.92,5.79 32.92,6.55 32.31,7.16 29.11,7.16 | 31.09,5.18 28.5,5.18 IC2.3 | v27.13,16.31 27.13,17.68 U$6.5 | v27.13,10.97 28.04,10.06 C22.2 | v23.16,20.73 23.16,22.1 C4.2 | v25.45,10.67 24.69,10.67 M1.2 | v23.16,26.82 23.16,27.89 C3.2 | v19.96,15.85 20.27,16.15 20.27,16.92 20.12,17.07 19.51,17.07 IC1.12 | v19.96,13.26 19.96,11.43 D1.ANODE | v29.11,8.08 29.11,7.16 | 68.43,20.42 68.43,19.2 PWM1.VCC | 68.43,20.42 68.43,21.79 PWM0.VCC | v51.21,8.23 49.53,8.23 U$9.28 | PWM4.VCC 68.43,11.12 68.43,8.69 PWM5.VCC | PWM2.VCC 68.43,16.46 68.43,13.87 PWM3.VCC | C18.2 54.25,23.77 54.25,26.21 54.41,26.36 C17.2 54.56,26.52 56.24,28.19 | 57.45,20.42 57.45,22.25 58.06,22.86 58.06,26.82 56.69,28.19 56.24,28.19 | 57.45,20.42 57.45,20.12 C21.2 | SERIAL(34,35).VCC 34.14,31.85 34.14,31.39 41.6,23.93 41.6,22.55 44.96,19.2 56.54,19.2 57.3,19.96 C21.2 | 57.45,20.42 68.43,20.42
  Top 0.152: 57.45,20.42 C21.2 | v31.09,4.12 31.09,5.18
  Bottom 0.152: 23.77,19.66 v27.13,16.31 v27.13,10.97 26.82,10.67 | 23.77,19.66 23.16,20.27 v23.16,20.73 v23.16,26.82 | 26.82,10.67 v25.45,10.67 | 23.77,19.66 v19.96,15.85 v19.96,13.26 | v29.11,8.08 29.11,8.38 26.82,10.67 | PWM2.VCC 68.43,16.61 68.43,19.05 PWM1.VCC | PWM4.VCC 68.43,11.28 68.43,13.72 PWM3.VCC | PWM5.VCC 68.28,8.53 67.21,7.47 65.38,7.47 64.62,8.23 v51.21,8.23 47.09,4.12 v31.09,4.12
DTR  (via drill 0.3)
  Top 0.152: R13.2 3.66,6.25 5.79,6.25 6.71,7.16 7.32,7.16 7.77,7.62 7.77,9.14 T2.2 7.92,9.3 8.69,10.06 9.75,10.06 10.36,9.45 11.12,9.45 T3.2 11.28,9.45 v13.87,12.04 | v17.22,20.88 17.22,19.81 IC1.18
  Bottom 0.152: v17.22,20.88 17.22,15.39 v13.87,12.04
EN  (via drill 0.3)
  Top 0.152: v1.83,21.18 1.83,12.8 2.9,11.73 3.35,11.73 T1.3 | v5.18,24.54 10.82,24.54 11.58,25.3 v17.07,25.3 17.98,25.3 R8.1 18.14,25.3 20.42,23.01 20.42,21.64 20.12,21.34 19.36,21.34 18.59,22.1 18.14,22.1 R9.1 | v22.25,30.02 22.55,30.33 23.01,30.33 C8.2 | v10.97,48.62 11.28,48.92 11.28,51.97 7.77,55.47 7.16,55.47 U$1.P$3
  Bottom 0.152: v5.18,24.54 v1.83,21.18 | 21.79,30.02 v22.25,30.02 | v17.07,25.3 21.79,30.02 | v10.97,48.62 21.79,37.8 21.79,30.02
GND  (via drill 0.3, 0.35)
  Top 0.152: C20.1 72.24,40.23 72.08,40.39 72.08,43.13 C24.1 71.93,43.28 71.93,45.87 69.04,48.77 69.04,49.23 68.28,49.99 64.16,49.99 P2.GND 64.01,50.14 61.72,52.43 58.22,52.43 A5.- 58.06,52.58 54.86,52.58 53.95,53.49 46.18,53.49 | C18.1 52.58,23.77 52.58,26.21 52.73,26.36 C17.1 52.88,26.52 52.88,36.12 53.8,37.03 | 55.78,22.1 55.78,20.12 C21.1 | 55.78,22.1 57.15,23.47 R17.1 57.15,23.62 R7.1 | 55.78,22.1 54.41,22.1 52.88,23.62 52.58,23.62 C18.1 | MAX1.13 27.58,55.78 28.19,56.39 MAX1.12 28.35,56.54 28.65,56.54 MAX1.11 | MAX1.6 30.63,54.71 30.63,54.41 MAX1.5 30.48,54.41 29.26,54.41 | 29.26,54.41 29.26,54.86 29.11,55.02 MAX1.EP | 29.26,54.41 29.26,53.49 MAX1.3 | MAX1.15 27.58,54.86 28.8,54.86 28.96,55.02 MAX1.EP | MAX1.11 28.8,56.39 28.8,55.32 28.96,55.17 MAX1.EP | 35.05,52.43 33.83,52.43 33.07,53.19 32.77,53.19 C16.1 | 35.05,52.43 35.36,52.73 35.36,56.84 35.05,57.15 33.38,57.15 32.77,56.54 C15.1 | U$8.5 61.42,33.53 61.42,37.19 60.05,38.56 D2.CATHODE | R35.1 54.41,43.13 54.86,43.13 55.63,43.89 56.54,43.89 59.89,40.54 59.89,38.71 D2.CATHODE | 53.8,37.03 50.9,39.93 50.9,40.23 C25.1 50.9,40.39 50.9,42.98 R34.1 50.9,43.13 46.18,43.13 | 53.8,37.03 58.37,37.03 59.89,38.56 D2.CATHODE | 35.05,52.43 35.05,51.97 43.89,43.13 46.18,43.13 | 46.18,43.13 46.18,53.49 | 46.18,53.49 46.18,56.69 44.81,58.06 29.72,58.06 28.8,57.15 28.8,56.54 MAX1.11 | 56.69,16.76 57.45,16.76 57.61,16.61 R31.1 | 56.69,16.76 55.32,16.76 U$9.14 | v56.69,16.46 56.69,16.76 | R30.1 57.76,13.87 58.22,13.41 58.22,12.8 57.76,12.34 57.76,11.43 R29.1 57.76,11.28 57.76,10.97 59.59,9.14 60.05,9.14 61.11,8.08 | 61.11,8.08 61.42,8.38 R23.1
  Top 0.152: 61.11,8.08 60.66,7.62 58.83,7.62 58.06,8.38 57.76,8.38 R28.1 | 61.11,8.08 R23.1 | 56.84,4.88 57,4.72 58.22,4.72 58.52,5.03 58.52,6.1 58.67,6.25 60.66,6.25 61.27,5.64 R27.1 61.42,5.49 61.72,5.49 62.48,4.72 63.55,4.72 64.47,5.64 | 56.84,4.88 56.39,5.33 54.56,5.33 53.95,4.72 53.49,4.72 R24.1 | PWM4.GND 65.84,11.12 65.84,8.69 PWM5.GND 65.84,8.53 65.84,7.01 64.47,5.64 | 64.47,5.64 63.7,6.4 63.55,6.4 61.57,8.38 R23.1 | PWM2.GND 65.84,16.46 65.84,13.87 PWM3.GND | C14.1 26.82,2.29 27.28,2.74 27.28,5.18 IC2.2 27.28,5.33 28.04,6.1 31.85,6.1 IO4.GND | C13.1 23.01,2.13 23.32,2.13 24.08,2.9 26.06,2.9 26.67,2.29 C14.1 | I2C2.GND 42.67,31.85 42.67,23.01 I2C1.GND 42.67,22.86 43.59,21.95 49.38,21.95 51.05,23.62 52.43,23.62 C18.1 | IO27.GND 40.54,6.1 42.06,4.57 49.53,4.57 R25.1 49.53,4.42 50.6,3.35 55.32,3.35 56.84,4.88 | IO14.GND 40.39,14.33 40.39,6.25 IO27.GND | C14.1 26.82,2.13 27.13,2.13 27.89,1.37 35.66,1.37 40.39,6.1 IO27.GND | 14.02,13.11 12.8,13.11 C12.1 | 14.02,13.11 15.7,11.43 D1.CATHODE 15.7,11.28 13.11,8.69 C1.1 12.95,8.53 12.19,7.77 12.19,6.55 | 12.19,6.55 12.5,6.25 13.26,6.25 14.63,4.88 14.63,4.72 15.09,4.27 USB1.5 | 20.27,21.03 20.42,21.03 21.49,22.1 C4.1 | 20.27,21.03 17.98,21.03 17.22,21.79 16.31,21.79 Q3.2 | 12.34,19.81 11.58,19.81 C5.1 | 14.48,17.68 12.34,19.81 | 14.48,17.68 15.09,17.68 IC1.3 15.24,17.68 17.22,17.68 IC1.21 17.37,17.68 19.36,17.68 IC1.13 19.51,17.68 20.12,17.68 20.27,17.83 20.27,21.03 | v13.26,21.79 12.5,21.79 Q4.2 | 12.34,19.81 v12.5,19.96 | 14.02,13.11 14.02,17.22 14.48,17.68 | 21.49,26.82 21.49,27.89 C3.1 | 21.49,26.82 21.49,25.45 C2.1
  Top 0.152: 21.49,26.82 19.2,26.82 18.14,27.89 R6.1 17.98,27.89 16.61,26.52 15.39,26.52 14.94,26.98 14.94,27.74 C7.1 10.97,27.89 8.69,30.18 8.69,32.31 | 2.59,21.79 2.59,23.93 EN.2 2.74,24.08 2.74,27.89 5.79,30.94 BOOT..GND 5.94,31.09 7.16,32.31 8.38,32.31 | 2.59,21.79 2.59,19.96 EN.1 2.74,19.81 3.5,19.05 4.72,19.05 5.03,19.36 5.03,19.81 6.4,21.18 6.4,22.1 C11.1 | v5.03,16.76 5.18,16.92 6.4,16.92 R10.1 | 8.38,32.31 8.69,32.31 | 8.69,32.31 9.45,32.31 C9.1 | 8.38,32.31 8.38,39.62 7.77,40.23 7.16,40.23 U$1.P$15 | 12.19,6.55 11.89,6.55 10.52,5.18 2.9,5.18 1.22,6.86 1.22,21.34 1.68,21.79 2.59,21.79 | 14.63,51.05 7.77,57.91 7.16,57.91 U$1.P$1 | 14.63,51.05 14.63,50.6 U$1.P$39 | 14.63,51.05 21.49,57.91 24.84,57.91 U$1.P$38 | 14.63,51.05 U$1.P$39 | R33.1 21.95,17.68 21.95,15.54 R32.1 21.95,15.39 21.34,15.39 18.44,12.5 18.44,6.4 18.9,5.94 23.01,5.94 24.23,7.16 C6.+ 24.38,7.32 24.38,8.08 26.21,9.91 C22.1 26.36,10.06 26.36,11.73 | 26.36,11.73 26.36,12.5 C23.1 | 26.36,11.73 28.96,11.73 31.55,14.33 31.85,14.33 IO12.GND | MIC(IO5,19,15).GND 30.79,40.69 30.79,39.17 26.06,34.44 25.91,34.44 21.95,30.48 21.49,30.48 C8.1 21.34,30.48 19.51,32.31 15.24,32.31 C10.1 15.24,32.46 14.78,32.92 | 14.78,32.92 14.78,50.44 U$1.P$39 | 14.78,32.92 v14.33,32.92
  Bottom 0.152: v56.69,16.46 65.84,16.46 PWM2.GND 65.84,16.61 65.84,19.05 PWM1.GND 65.84,19.2 65.84,21.79 PWM0.GND | PWM3.GND 65.84,13.72 65.84,11.28 PWM4.GND | I2C1.GND 42.52,22.86 42.52,21.34 40.54,19.36 40.54,14.48 IO14.GND 40.39,14.33 37.64,14.33 36.73,13.41 32.92,13.41 32,14.33 IO12.GND 32,14.48 32,22.86 I2C.GND 32,23.01 32,31.85 SERIAL(34,35).GND 32,32 30.94,33.07 30.94,40.69 MIC(IO5,19,15).GND | v13.26,21.79 13.26,20.73 v12.5,19.96 | v5.03,16.76 3.96,16.76 1.22,19.51 1.22,26.36 5.79,30.94 BOOT..GND 5.94,30.94 9.14,30.94 10.36,29.72 11.12,29.72 v14.33,32.92
  other vias: 10.8,44.8 9.3,50.1 8.8,45.8 27,44.3 41.3,43.9 38.9,39.9 25.8,30.8 12.7,24.2 31.4,10.6 49.3,7.4 57.7,29.1 47.7,36.6 53.7,41.3 69.1,41.9 37.3,56.7 47.6,15.3 27.2,47.8
  pour Bottom: 0,0 78.74,0 78.74,59.69 0,59.69
  pour Top: 0,0 78.74,0 78.74,59.69 0,59.69
GPIO21
  Top 0.152: U$8.6 57,33.53 57,33.98 56.24,34.75 LED1.CATHODE
IO0  (via drill 0.3)
  Top 0.152: v9.3,14.17 6.86,11.73 T2.3 | v10.52,23.77 11.43,23.77 Q4.3 | v17.07,29.87 17.53,30.33 17.98,30.33 R5.1 | v17.07,34.29 24.23,41.45 24.84,41.45 U$1.P$25
  Bottom 0.152: v9.3,14.17 9.3,19.51 5.79,23.01 5.79,23.32 6.25,23.77 v10.52,23.77 13.26,26.52 15.7,26.52 17.07,27.89 v17.07,29.87 v17.07,34.29
IO2  (via drill 0.3)
  Top 0.152: v10.82,10.82 10.36,11.28 10.36,11.58 T3.3 | v19.05,9.3 19.96,9.3 v20.27,9.6 | v16.15,23.62 15.39,23.62 15.24,23.77 Q3.3 | v20.57,27.43 20.12,27.89 19.81,27.89 R6.2 | v22.86,32.16 22.86,38.86 24.23,40.23 24.84,40.23 U$1.P$24
  Bottom 0.152: v10.82,10.82 11.12,10.82 11.43,11.12 17.22,11.12 v19.05,9.3 | v20.27,9.6 20.27,11.28 17.37,14.17 17.37,15.09 17.83,15.54 17.83,21.95 16.46,23.32 | v16.15,23.62 16.46,23.32 | 16.46,23.32 v20.57,27.43 22.86,29.72 v22.86,32.16
IO4  (via drill 0.3)
  Top 0.152: v26.98,41.3 25.6,42.67 24.99,42.67 U$1.P$26 | v30.79,31.85 38.56,24.08 38.71,24.08 44.35,18.44 44.35,15.39 | 44.35,15.39 44.35,14.48 IO14.I/O 44.5,14.33 44.5,6.25 IO27.I/O | 44.35,15.39 39.93,15.39 35.97,11.43 35.97,6.25 IO4.I/O
  Bottom 0.152: v26.98,41.3 26.98,35.66 v30.79,31.85
IO5
  Top 0.152: U$1.P$29 24.99,46.48 29.26,46.48 30.79,44.96 MIC(IO5,19,15).DATA
IO12
  Top 0.152: U$1.P$14 7.16,41.45 7.77,41.45 10.36,38.86 10.36,31.24 11.58,30.02 13.41,30.02 14.78,28.65 23.62,28.65 24.08,28.19 24.08,27.28 25.76,25.6 25.76,24.84 28.19,22.4 29.57,22.4 35.81,16.15 35.81,14.48 IO12.I/O
IO15  (via drill 0.3)
  Top 0.152: v29.57,43.13 25.45,39.01 24.99,39.01 U$1.P$23
  Bottom 0.152: v29.57,43.13 29.57,47.4 30.79,48.62 MIC(IO5,19,15).WS
IO19
  Top 0.152: U$1.P$31 24.99,49.07 28.5,49.07 30.79,46.79 MIC(IO5,19,15).BCLK
IO23
  Top 0.152: U$1.P$32 24.99,50.44 25.45,50.44 26.21,51.21 26.21,56.08 25.6,56.69 24.99,56.69 U$1.P$37
IO25
  Top 0.152: MAX1.14 27.43,55.32 26.82,55.32 26.52,55.63 26.52,58.22 25.91,58.83 6.1,58.83 5.49,58.22 5.49,47.7 6.55,46.63 7.01,46.63 U$1.P$10
IO26
  Top 0.152: MAX1.16 27.43,54.25 27.43,53.19 27.13,52.88 27.13,52.58 28.5,51.21 30.18,51.21 31.85,49.53 31.85,38.71 23.77,30.63 23.77,29.87 23.16,29.26 14.63,29.26 13.56,30.33 11.73,30.33 10.67,31.39 10.67,39.01 8.38,41.3 8.38,44.65 7.77,45.26 7.16,45.26 U$1.P$11
IO27  (via drill 0.3)
  Top 0.152: v27.74,52.73 27.74,52.88 28.19,53.34 MAX1.1 | v5.64,44.96 6.4,44.2 7.01,44.2 U$1.P$12
  Bottom 0.152: v27.74,52.73 25.91,52.73 23.47,55.17 15.85,55.17 v5.64,44.96
IO32
  Top 0.152: C10.2 13.26,30.63 12.34,31.55 CY1.P$1 12.19,31.7 11.28,32.61 11.28,38.86 9.6,40.54 9.6,47.24 7.77,49.07 7.16,49.07 U$1.P$8
IO34  (via drill 0.3)
  Top 0.152: v10.67,51.82 7.16,51.82 U$1.P$6
  Bottom 0.152: v10.67,51.82 12.04,51.82 15.7,55.47 25.91,55.47 45.57,35.81 45.57,31.39 45.11,30.94 39.01,30.94 38.1,31.85 SERIAL(34,35).RX
IO35  (via drill 0.3)
  Top 0.152: 10.52,30.48 10.67,30.48 11.89,29.26 12.19,29.26 CY1.P$2 | 10.52,30.48 9.6,30.48 C9.2 | U$1.P$9 7.01,48.01 6.4,48.01 5.79,48.62 5.79,49.68 6.4,50.29 7.01,50.29 U$1.P$7 7.16,50.44 7.92,50.44 v8.69,51.21 | v10.52,30.33 10.52,30.48
  Bottom 0.152: SERIAL(34,35).TX 36.12,31.85 37.34,30.63 55.02,30.63 55.78,31.39 55.78,32.46 39.32,48.92 32.92,48.92 26.06,55.78 13.26,55.78 v8.69,51.21 5.03,47.55 5.03,44.81 10.52,39.32 v10.52,30.33
LED0  (via drill 0.3)
  Top 0.152: v56.08,12.19 55.63,11.73 55.32,11.73 U$9.6 | v60.66,21.03 61.42,21.79 R18.1
  Bottom 0.152: v56.08,12.19 56.08,16.61 58.06,18.59 59.89,18.59 60.66,19.36 v60.66,21.03
LED1  (via drill 0.3)
  Top 0.152: v54.25,13.56 54.25,12.95 54.86,12.34 55.17,12.34 U$9.7 | v59.74,19.2 61.27,19.2 R19.1
  Bottom 0.152: v54.25,13.56 54.25,15.24 58.22,19.2 v59.74,19.2
LED2  (via drill 0.3)
  Top 0.152: v57.61,12.95 55.32,12.95 U$9.8 | v60.35,15.7 61.27,16.61 R20.1
  Bottom 0.152: v60.35,15.7 v57.61,12.95
LED3  (via drill 0.3)
  Top 0.152: v56.69,13.56 55.32,13.56 U$9.9 | v58.52,15.39 59.89,15.39 61.27,14.02 R21.1
  Bottom 0.152: v58.52,15.39 v56.69,13.56
LED4
  Top 0.152: U$9.10 55.32,14.33 56.69,14.33 57.15,14.78 60.05,14.78 60.5,14.33 60.5,12.04 61.11,11.43 R22.1
LED5  (via drill 0.3)
  Top 0.152: v53.65,12.8 53.65,13.72 54.71,14.78 55.17,14.78 U$9.11 | v53.65,8.99 57,5.64 57.61,5.64 R26.1
  Bottom 0.152: v53.65,8.99 v53.65,12.8
M1_1
  Top 0.152: U$8.1 61.57,31.55 63.4,31.55 63.55,31.7 C19.2 63.7,31.7 68.12,31.7 69.49,30.33 U$12.LEFT1 69.65,30.18 74.52,30.18 U$12.LEFT2
M1_2
  Top 0.152: U$8.3 61.57,32.61 62.64,32.61 63.55,33.53 C19.1 63.7,33.68 68.12,33.68 69.49,35.05 U$12.RIGHT1 69.65,35.2 74.52,35.2 U$12.RIGHT2
N$1
  Top 0.152: R13.1 3.5,7.92 3.5,8.23 2.59,9.14 T1.1
N$2
  Top 0.152: R14.1 6.71,7.92 6.71,8.38 5.94,9.14 T2.1
N$3
  Top 0.152: 27.28,21.79 27.28,20.88 26.52,20.12 26.52,19.66 R2.1 | 27.28,21.79 24.38,24.69 23.77,24.69 23.16,25.3 C2.2 | 27.28,21.79 27.58,22.1 29.41,22.1 32.92,18.59 32.92,13.72 28.35,9.14 26.67,9.14 25.91,8.38 25.91,7.01 24.54,5.64 19.05,5.64 18.29,4.88 18.29,3.35 18.14,3.2 17.53,3.2 17.22,3.5 17.22,4.12 USB1.2
N$4
  Top 0.152: 14.48,6.86 13.11,6.86 C1.2 | 14.48,6.86 16.46,4.88 16.46,4.27 USB1.3 | 14.48,6.86 17.37,9.75 17.37,11.89 20.57,15.09 20.57,17.53 21.79,18.75 26.82,18.75 27.74,19.66 28.8,19.66 R1.1
N$5
  Top 0.152: 4.27,23.77 4.27,23.93 EN.3 4.27,23.77 | 4.27,23.77 4.27,19.96 EN.4 | 4.27,23.77 6.55,23.77 8.08,22.25 C11.2 8.23,22.25 8.99,23.01 18.44,23.01 19.2,22.25 19.66,22.25 R9.2
N$6
  Top 0.152: 4.27,13.56 4.27,17.53 BOOT.3 | 8.23,14.78 8.23,16.92 R10.2 8.23,17.07 8.23,19.51 R11.2 | 8.23,14.78 8.23,14.48 R12.2 | 8.23,14.78 12.65,14.78 C12.2 | 8.23,14.78 R12.2 | 4.27,13.56 7.32,13.56 8.08,14.33 R12.2 | 4.27,13.56 BOOT.4
N$7  (via drill 0.3)
  Top 0.152: IC1.11 19.36,16.61 18.29,15.54 IC1.10 18.29,15.39 18.29,14.78 18.59,14.48 18.59,14.17 18.14,13.72 15.85,13.72 v14.63,14.94 | v13.11,18.29 11.58,18.29 C5.2 | v14.48,19.66 16.15,19.66 IC1.20
  Bottom 0.152: v14.48,19.66 v13.11,18.29 14.63,16.76 v14.63,14.94
N$8
  Top 0.152: R15.1 10.06,7.92 10.06,8.69 9.45,9.3 T3.1
N$9
  Top 0.152: MAX1.10 29.26,57.15 29.87,57.76 37.49,57.76 39.78,55.47 U$4.RIGHT2 39.78,55.32 39.78,50.44 U$4.RIGHT1
N$10
  Top 0.152: MAX1.9 29.72,56.54 31.55,56.54 32.46,57.45 35.2,57.45 38.41,54.25 38.41,49.07 38.56,48.92 43.28,48.92 44.65,50.29 U$4.LEFT1 44.81,50.44 44.81,55.32 U$4.LEFT2
N$11
  Top 0.152: R11.1 6.55,19.66 7.62,20.73 9.3,20.73 10.36,21.79 Q4.1
N$12
  Top 0.152: R12.1 6.55,14.48 6.55,15.85 7.47,16.76 7.47,20.12 7.77,20.42 10.82,20.42 10.97,20.57 12.95,20.57 14.17,21.79 Q3.1
N$13
  Top 0.152: U$8.2 61.42,32 61.11,32 58.98,29.87 58.98,26.36 R7.2 58.98,26.21 58.98,23.62 R17.2
N$14
  Top 0.152: LED1.ANODE 54.56,34.75 54.56,30.02 R16.1
N$15
  Top 0.152: P1.P$1 67.21,44.5 67.21,47.4 P2.VCC
N$16
  Top 0.152: U$6.6 26.06,17.83 26.67,18.44 28.35,18.44 28.8,17.98 28.8,13.26 28.19,12.65 C23.2 28.04,12.65 27.28,13.41 25.91,13.41 25.6,13.11 23.62,13.11 M1.3 23.47,12.95 23.47,10.21 23.01,9.75 22.55,9.75 19.96,7.16 19.51,7.16 F1.2
N$17
  Top 0.152: 24.23,14.94 23.77,15.39 R32.2 | 24.23,14.94 24.54,14.63 28.35,14.63 28.5,14.78 28.5,15.85 28.04,16.31 28.04,17.68 U$6.4 | 24.23,14.94 22.71,13.41 22.71,10.67 M1.1
N$18  (via drill 0.3)
  Top 0.152: v54.25,10.67 53.34,11.58 49.53,11.58 U$9.23 | v62.33,9.3 63.09,8.53 R23.2
  Bottom 0.152: v54.25,10.67 55.17,10.67 56.69,9.14 62.18,9.14 v62.33,9.3
N$19
  Top 0.152: U$9.25 49.38,10.21 48.16,10.21 47.7,9.75 47.7,7.77 50.44,5.03 50.44,3.96 50.75,3.66 54.1,3.66 55.02,4.57 R24.2
N$20
  Top 0.152: U$9.1 55.32,8.23 56.54,8.23 58.22,6.55 62.03,6.55 62.94,5.64 R27.2
N$21
  Top 0.152: U$9.2 55.32,9.14 58.83,9.14 59.44,8.53 R28.2
N$22  (via drill 0.3)
  Top 0.152: v58.22,9.75 55.32,9.75 U$9.3 | v59.28,10.21 59.28,11.12 59.44,11.28 R29.2
  Bottom 0.152: v58.22,9.75 58.83,9.75 v59.28,10.21
N$23  (via drill 0.3)
  Top 0.152: v56.24,10.36 55.32,10.36 U$9.4 | v58.83,12.95 58.83,13.26 59.44,13.87 R30.2
  Bottom 0.152: v58.83,12.95 v56.24,10.36
N$24
  Top 0.152: U$9.5 55.17,10.97 54.71,10.97 53.03,12.65 53.03,15.54 54.86,17.37 58.67,17.37 59.44,16.61 R31.2
N$25
  Top 0.152: U$9.24 49.53,10.82 49.84,10.82 51.82,8.84 51.82,5.03 51.36,4.57 R25.2
N$26
  Top 0.152: 26.06,15.39 26.98,15.39 U$6.2 27.13,15.39 27.89,15.39 U$6.3 | 26.06,15.39 23.77,17.68 R33.2 | 26.06,15.39 U$6.1
N$28
  Top 0.152: U$7.6 54.1,40.23 52.58,40.23 C25.2 52.43,40.39 52.43,42.06 51.97,42.52 51.97,43.59 53.03,44.65 62.18,44.65 M2.3 62.33,44.65 63.86,44.65 67.06,41.45 P1.P$2
N$29
  Top 0.152: U$7.4 56.08,40.23 53.95,42.37 53.34,42.37 52.73,42.98 R34.2 52.73,43.13 53.8,44.2 56.69,44.2 58.37,42.52 61.11,42.52 M2.1
N$30
  Top 0.152: U$7.1 54.25,37.64 55.17,37.64 U$7.2 55.32,37.64 56.08,37.64 U$7.3 56.24,37.8 56.69,38.25 56.69,40.69 56.08,41.3 56.08,42.98 R35.2
PWM0
  Top 0.152: R18.2 63.25,21.95 64.31,21.95 65.53,23.16 69.65,23.16 70.87,21.95 PWM0.I/O
PWM1
  Top 0.152: R19.2 63.09,19.2 64.16,19.2 65.38,17.98 69.8,17.98 70.87,19.05 PWM1.I/O
PWM2
  Top 0.152: R20.2 63.09,16.61 64.31,16.61 65.38,17.68 69.8,17.68 70.87,16.61 PWM2.I/O
PWM3
  Top 0.152: R21.2 63.09,13.87 64.16,13.87 65.38,12.65 69.8,12.65 70.87,13.72 PWM3.I/O
PWM4
  Top 0.152: R22.2 63.09,11.43 64.47,11.43 65.38,12.34 69.8,12.34 70.87,11.28 PWM4.I/O
PWM5
  Top 0.152: R26.2 59.44,5.49 60.05,5.49 61.11,4.42 66.75,4.42 70.87,8.53 PWM5.I/O
RTS
  Top 0.152: R15.2 10.06,6.1 6.86,6.1 R14.2 6.71,6.1 6.1,5.49 3.05,5.49 2.74,5.79 2.74,6.55 3.05,6.86 3.81,6.86 4.42,7.47 4.42,9.14 T1.2 4.27,9.3 4.27,12.04 3.35,12.95 3.35,18.14 3.5,18.29 4.42,18.29 5.33,19.2 5.33,19.66 6.71,21.03 8.23,21.03 9.91,22.71 14.63,22.71 14.94,22.4 14.94,21.95 15.85,21.03 16.15,21.03 16.76,20.42 16.76,19.81 IC1.19
RXD  (via drill 0.3)
  Top 0.152: v19.66,20.42 19.51,20.57 17.98,20.57 17.83,20.42 17.83,19.81 IC1.17 | v22.4,20.42 22.71,20.42 23.01,20.12 23.32,20.12 23.77,20.57 v23.77,21.34 | v22.1,50.75 24.23,52.88 24.84,52.88 U$1.P$34
  Bottom 0.152: v22.4,20.42 v19.66,20.42 | v23.77,21.34 23.77,36.27 22.1,37.95 v22.1,50.75
SCL  (via drill 0.3)
  Top 0.152: v55.17,31.55 57,31.55 U$8.10 | v48.46,9.6 49.38,9.6 U$9.26 | I2C2.SCL 48.62,31.85 48.62,23.01 I2C1.SCL | 27.58,27.89 33.07,27.89 37.95,23.01 I2C.SCL | 27.58,27.89 26.52,27.89 R4.2 | v23.32,54.56 24.23,55.47 24.84,55.47 U$1.P$36 | 27.58,27.89 v27.58,33.68
  Bottom 0.152: v55.17,31.55 48.92,31.55 48.62,31.85 I2C2.SCL | v48.46,9.6 48.46,22.86 I2C1.SCL 48.46,23.01 48.01,23.01 46.63,24.38 40.54,24.38 39.17,23.01 38.1,23.01 I2C.SCL | v23.32,54.56 23.32,37.95 v27.58,33.68
SDA  (via drill 0.3)
  Top 0.152: v55.17,32.31 55.47,32 57,32 U$8.9 | v48.31,8.84 48.46,8.99 U$9.27 | I2C2.SDA 46.63,31.85 46.63,23.01 I2C1.SDA | v28.65,25.45 26.52,25.45 R3.2 | v31.39,25.6 33.38,25.6 35.97,23.01 I2C.SDA | v22.71,50.14 24.23,51.66 24.84,51.66 U$1.P$33
  Bottom 0.152: v55.17,32.31 49.99,32.31 49.38,32.92 47.55,32.92 46.63,32 I2C2.SDA | v48.31,8.84 46.79,10.36 46.79,22.71 46.63,22.86 I2C1.SDA 46.48,23.01 46.02,23.01 44.96,24.08 40.84,24.08 38.71,21.95 37.03,21.95 36.12,22.86 I2C.SDA | v31.39,25.6 31.24,25.45 v28.65,25.45 28.65,31.85 22.71,37.8 v22.71,50.14
TXD  (via drill 0.3)
  Top 0.152: v13.87,20.73 13.87,19.51 14.63,18.75 15.09,18.75 IC1.1 | v17.68,41.15 17.68,47.55 24.23,54.1 24.84,54.1 U$1.P$35
  Bottom 0.152: v13.87,20.73 13.87,24.23 17.68,28.04 v17.68,41.15
USBDM  (via drill 0.3)
  Top 0.152: v22.25,23.01 23.62,23.01 25.15,21.49 26.36,21.49 R2.2 | v17.98,14.33 17.98,14.63 17.83,14.78 17.83,15.39 IC1.9
  Bottom 0.152: v22.25,23.01 21.49,23.01 18.14,19.66 18.14,14.48 v17.98,14.33
USBDP  (via drill 0.3)
  Top 0.152: v30.63,14.17 30.63,19.2 28.96,20.88 28.96,21.34 R1.2 | v13.11,12.04 v11.58,10.52 | v15.7,14.63 17.07,14.63 17.22,14.78 17.22,15.39 IC1.8
  Bottom 0.152: v30.63,14.17 35.97,8.84 41,8.84 43.43,6.4 43.43,5.79 42.37,4.72 17.37,4.72 v11.58,10.52 | v15.7,14.63 v13.11,12.04
VBUS
  Top 0.152: USB1.1 17.68,4.27 17.68,5.79 16.46,7.01 F1.1

### Text on the board
tPlace: Speaker | REV.BETA1 | Motor